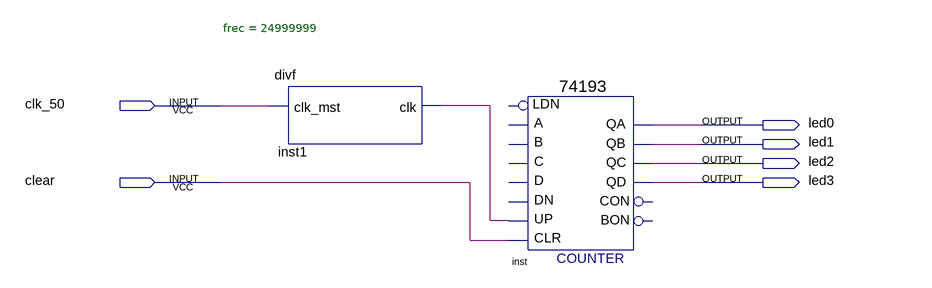
[diagram p0: schematic sheet]
// Quartus schematic practica01_main.bdf as structural Verilog: 2 symbols, 6 pins
module practica01_main (
  input  clk_50,
  input  clear,
  output led0,
  output led1,
  output led2,
  output led3
);

  wire inst1_clk;

  divf #(.frec(24999999)) inst1 (.clk_mst(clk_50), .clk(inst1_clk));
  \74193  inst (
    .CLR(clear), .UP(inst1_clk), .QB(led1), .QA(led0), .QD(led3), .QC(led2));  // open: D, C, B, A, DN, LDN, CON, BON
endmodule
